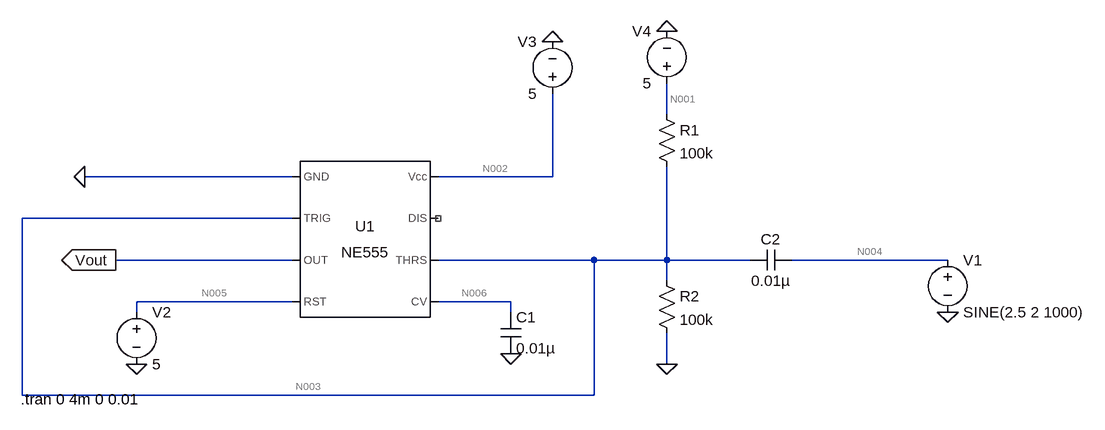
[diagram p0: schematic 10.555 Schmitt trigger.asc]
10.555 Schmitt trigger.asc, the LTspice schematic file:
Version 4
SHEET 1 1348 680
WIRE 688 0 688 -48
WIRE 112 96 -208 96
WIRE 512 96 512 -32
WIRE 512 96 336 96
WIRE 112 160 -304 160
WIRE 112 224 -160 224
WIRE 576 224 336 224
WIRE 688 224 688 80
WIRE 688 224 576 224
WIRE 816 224 688 224
WIRE 1120 224 880 224
WIRE 688 256 688 224
WIRE 112 288 -128 288
WIRE 448 288 336 288
WIRE -128 304 -128 288
WIRE 448 304 448 288
WIRE 688 384 688 336
WIRE -304 432 -304 160
WIRE 576 432 576 224
WIRE 576 432 -304 432
FLAG 688 -128 0
FLAG 512 -112 0
FLAG 1120 304 0
FLAG -128 384 0
FLAG -208 96 0
FLAG 448 368 0
FLAG 688 384 0
FLAG -160 224 Vout
IOPIN -160 224 Out
SYMBOL Misc\\NE555 224 192 R0
SYMATTR InstName U1
SYMBOL cap 432 304 R0
SYMATTR InstName C1
SYMATTR Value 0.01µ
SYMBOL cap 816 240 R270
WINDOW 0 32 32 VTop 2
WINDOW 3 0 32 VBottom 2
SYMATTR InstName C2
SYMATTR Value 0.01µ
SYMBOL voltage 1120 208 R0
WINDOW 123 0 0 Left 0
WINDOW 39 0 0 Left 0
SYMATTR InstName V1
SYMATTR Value SINE(2.5 2 1000)
SYMBOL voltage -128 288 R0
WINDOW 123 0 0 Left 0
WINDOW 39 0 0 Left 0
SYMATTR InstName V2
SYMATTR Value 5
SYMBOL voltage 512 -16 R180
WINDOW 0 24 96 Left 2
WINDOW 3 24 16 Left 2
WINDOW 123 0 0 Left 0
WINDOW 39 0 0 Left 0
SYMATTR InstName V3
SYMATTR Value 5
SYMBOL voltage 688 -32 R180
WINDOW 0 24 96 Left 2
WINDOW 3 24 16 Left 2
WINDOW 123 0 0 Left 0
WINDOW 39 0 0 Left 0
SYMATTR InstName V4
SYMATTR Value 5
SYMBOL res 672 -16 R0
SYMATTR InstName R1
SYMATTR Value 100k
SYMBOL res 672 240 R0
SYMATTR InstName R2
SYMATTR Value 100k
TEXT -306 438 Left 2 !.tran 0 4m 0 0.01

The netlist it stands for:
* 10.555 Schmitt trigger.asc
XU1 0 N003 Vout N005 N006 N003 NC_01 N002 NE555  ; pins GND TRIG OUT RST CV THRS DIS Vcc
C1 N006 0 0.01µ
C2 N003 N004 0.01µ
V1 N004 0 SINE(2.5 2 1000)
V2 N005 0 5
V3 N002 0 5
V4 N001 0 5
R1 N001 N003 100k
R2 N003 0 100k
.tran 0 4m 0 0.01
.lib NE555.sub
.backanno
.end

* Results of the author's LTspice run, read from the files saved beside the schematic
* Operating Point, zero values left out:
*   V(n003) = 2.5 V
*   V(n006) = 3.333 V
*   V(n002) = 5 V
*   V(vout) = 5 V
*   V(n005) = 5 V
*   V(n004) = 2.5 V
*   V(n001) = 5 V
*   I(R2) = 25 µA
*   I(R1) = 25 µA
*   I(V4) = -25 µA
*   I(V3) = -1.588 mA
*   I(V2) = -22.67 µA
*   Ix(u1:1) = -1.611 mA
*   Ix(u1:2) = 2.5 nA
*   Ix(u1:4) = 22.67 µA
*   Ix(u1:6) = 2.5 nA
*   Ix(u1:8) = 1.588 mA